# EAGLE design smart_motor_controller (EAGLE 9.0.0)
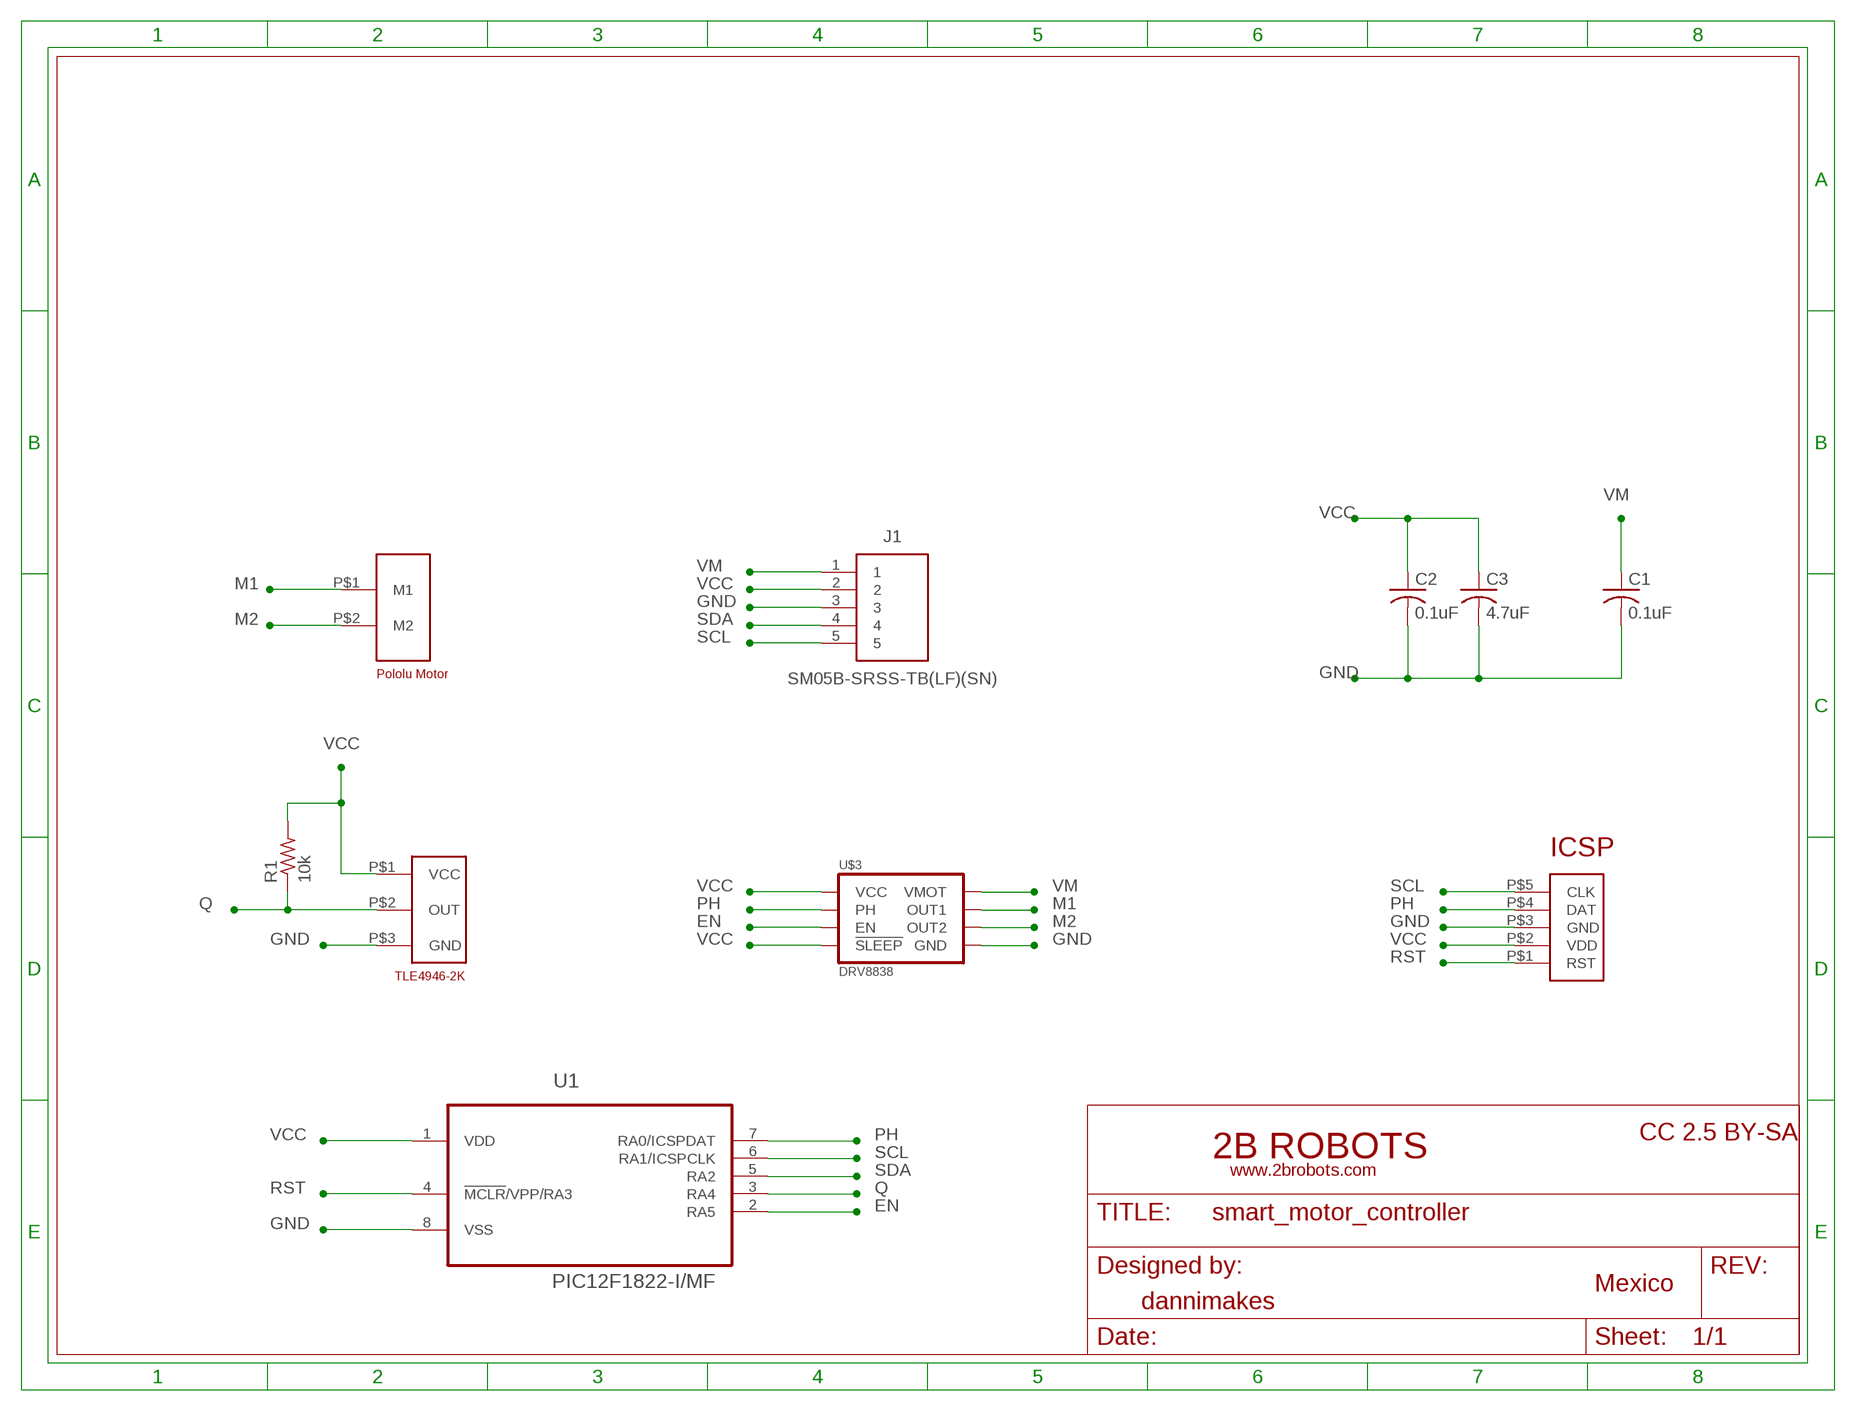
[diagram p0: schematic, sheet 1]

## Parts
C1  0.1uF  C-USC0603K  [C0603K]
C2  0.1uF  C-USC0603K  [C0603K]
C3  4.7uF  C-USC0805K  [C0805K]
J1  SM05B-SRSS-TB(LF)(SN)  [SM05B-SRSS-TB(LF)(SN)]
R1  10k  R-US_R0805  [R0805]
U1  PIC12F1822-I/MF  [DFN300X300X100-9N]
U$1  ICSP_POGO  [ICSP_POGO]
U$3  DRV8838  [DSG]
U$4  TLE4946-2K  [SC59]
U$5  POLOLU-MOTOR-BACK  [POLOL-MOTOR-BACK]

## Nets
EN: U1.2(RA5) U$3.5(EN)
GND: C1.2 C2.2 C3.2 J1.3 U1.8(VSS) U$1.P$3(GND) U$3.4(GND) U$3.PAD(GND) U$4.P$3(GND)
M1: U$3.2(OUT1) U$5.P$1(M1)
M2: U$3.3(OUT2) U$5.P$2(M2)
PH: U1.7(RA0/ICSPDAT) U$1.P$4(DAT) U$3.6(PH)
Q: R1.1 U1.3(RA4) U$4.P$2(OUT)
RST: U1.4(!MCLR!/VPP/RA3) U$1.P$1(RST)
SCL: J1.5 U1.6(RA1/ICSPCLK) U$1.P$5(CLK)
SDA: J1.4 U1.5(RA2)
VCC: C2.1 C3.1 J1.2 R1.2 U1.1(VDD) U$1.P$2(VDD) U$3.7(!SLEEP) U$3.8(VCC) U$4.P$1(VCC)
VM: C1.1 J1.1 U$3.1(VMOT)

## Library data of the parts
C1-C3 = adafruit:C-US: CAPACITOR, American symbol
J1 = SM05B-SRSS-TB(LF)(SN):SM05B-SRSS-TB(LF)(SN): czwka SMD, pozioma, 5 pinw <https://componentsearchengine.com/Images/9/SM05B-SRSS-TB%28LF%29%28SN%29.jpg> Source: Datasheet <http://www.jst-mfg.com/product/pdf/eng/eSH.pdf>; DESCRIPTION: czwka SMD, pozioma, 5 pinw; HEIGHT: mm; MANUFACTURER_NAME: JST (JAPAN SOLDERLESS TERMINALS); MANUFACTURER_PART_NUMBER: SM05B-SRSS-TB(LF)(SN); SUPPLIER_NAME: RS
R1 = adafruit:R-US_: RESISTOR, American symbol
U1 = Microchip-PIC12xxxx:PIC12: IC, 8BIT MCU, PIC12, 32MHZ, DFN-8; MPN: PIC12F1822-I/MF; OC_FARNELL: 1814913; OC_NEWARK: 63R7787; PACKAGE: DFN-8; SUPPLIER: MICROCHIP
U$1 = ICSP_POGO:ICSP_POGO
U$3 = packages(ti):DRV8838
U$4 = TLE4946-2K:TLE4946-2K
U$5 = pololu-motor-back:POLOLU-MOTOR-BACK

## Board
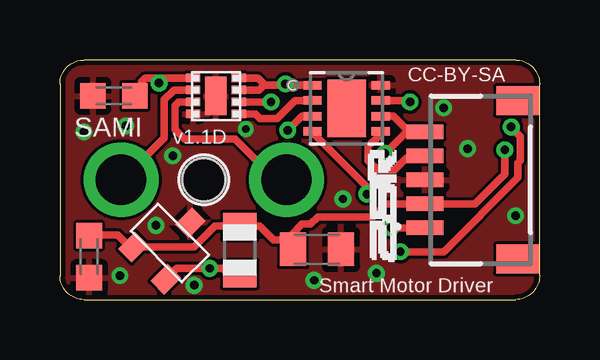
[diagram p1: board, top side]
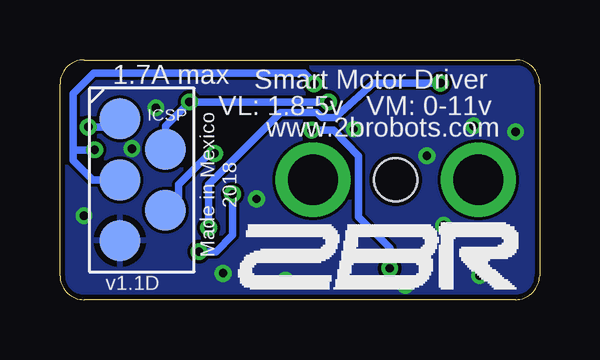
[diagram p2: board, bottom side, seen from below]

Size 20 x 10 mm. Coordinates in mm from the lower left corner, seen from the top.
Outline: 1,0 19,0 arc90 20,1 20,9 arc90 19,10 1,10 arc90 0,9 0,1 arc90 1,0
Copper layers (1*16): Top 0.0356mm / dielectric 1.5011mm / Bottom 0.0356mm
Design rules "test-5mil": minimum track width 6mil, minimum drill 0.3mm, track to track 5mil, track to pad 5mil, pad to pad 5mil, via to via 5mil, smd to smd 5mil, copper to edge 8mil, drill to drill 6mil, minimum pad ring 7mil, minimum via ring 7mil, stop-mask expansion 2.5mil, vias tented up to drill 50mil, thermal gap 10mil

### Footprints (pad centres in the part's own frame; a part is rotated, then mirrored left to right if it is on the bottom)
C0603K = smd 1.05 x 1.08: 1 -0.875,0; 2 0.875,0
C0805K = smd 1.1 x 1.4: 1 -1,0; 2 1,0
SM05B-SRSS-TB(LF)(SN) = smd 0.6 x 1.55: 1 -2,1; 2 -1,1; 3 0,1; 4 1,1; 5 2,1 | smd 1.2 x 1.8: 6 3.3,-2.875; 7 -3.3,-2.875
R0805 = smd 1.1 x 1.4: 1 -1,0; 2 1,0
DFN300X300X100-9N = smd 0.762 x 0.356: 1 -1.422,0.965; 2 -1.422,0.33; 3 -1.422,-0.33; 4 -1.422,-0.965; 5 1.422,-0.965; 6 1.422,-0.33; 7 1.422,0.33; 8 1.422,0.965 | smd 1.6 x 2.388: 9 0,0
ICSP_POGO = smd 1.7 x 1.7: P$1 -2.55,0; P$2 0.01,0; P$3 2.54,0; P$4 -1.275,1.9; P$5 1.275,1.9
DSG = smd 0.6 x 0.35: 1 -0.95,0.75; 2 -0.95,0.25; 3 -0.95,-0.25; 4 -0.95,-0.75; 5 0.95,-0.75; 6 0.95,-0.25; 7 0.95,0.25; 8 0.95,0.75 | smd 0.9 x 1.6: PAD 0,0
SC59 = smd 0.8 x 1: P$1 -0.9,-1.2; P$2 1,-1.2; P$3 0.05,1.2
POLOL-MOTOR-BACK = drill 2.1 pad 2.6: P$1 3.45,0; P$2 -3.45,0 | hole 1.8: 0,0

### Placement (x,y rotation side)
C1  2.25,8.5 180 top
C2  1.22,1.79 270 top
C3  10.72,2.1 0 top
J1  16.22,5 90 top
R1  7.5,2.07 90 top
U1  11.95,7.98 0 top
U$1  17.5,5 270 bottom
U$3  6.5,8.5 0 top
U$4  4.55,2.4 315 top
U$5  6,5 180 top

### Tracks (layer width: path | path; a pad name or v marks a point on that pad's centre or on a via)
EN
  Top 0.305: U$3.5 8.15,7.75 8.35,7.55 9.05,7.55 9.81,8.31 U1.2
GND  (via drill 0.3, 0.35)
  other vias: 2.5,1 1,7 2.75,7.25 4,3.1 7.75,7.12 5.6,0.6 10.6,0.8 13.2,1.1 19,3.5 17,6.3 16,8 11.8,4.2 4.7,6
  pour Top: 0,0 0,10 20,10 20,0
  pour Bottom: 0,0 20,0 20,10 0,10
M1
  Top 0.305: U$5.P$1 2.6,5 4.35,6.75 4.35,8.35 4.75,8.75 U$3.2
M2
  Top 0.305: U$3.3 4.95,8.25 4.9,8.2 4.8,8.1 4.8,7.1 5.2,6.7 7.3,6.7 9,5 U$5.P$2
PH  (via drill 0.35)
  Top 0.305: v14.6,8.25 14.54,8.31 U1.7 | U$3.6 v8.8,8.25
  Bottom 0.305: v8.8,8.25 v14.6,8.25 15.6,7.25 U$1.P$4
Q  (via drill 0.35)
  Top 0.305: U$4.P$2 4.86,1.3 v6.25,1.3 | R1.1 7.03,1.07 6.8,1.3 6.4,1.3 | v6.25,1.3 6.4,1.3 | 6.4,1.3 6.25,1.15 v6.25,1.3 | v9.5,7.07 10.1,7.65 U1.3
  Bottom 0.305: v6.25,1.3 6.25,2.15 7.55,3.45 7.55,6 8.6,7.07 v9.5,7.07
RST  (via drill 0.35)
  Top 0.305: 10.55,6.99 U1.4 10.53,6.97 12.8,4.7 v12.8,4.4 | v14.2,2 16,2 19.1,5.1 19.1,5.7 19.2,5.8 19.2,6.8 18.9,7.1 18.9,7.12 v18.82,7.2
  Bottom 0.305: v12.8,4.4 12.8,2.7 13.5,2 v14.2,2 | v14.2,2 14.3,2 v14.2,2 | v18.82,7.2 17.85,7.2 U$1.P$1
SCL  (via drill 0.35)
  Top 0.305: J1.5 15.17,7.05 14.55,7.05 | 14.55,7.05 14.5,7.05 | U1.6 13.9,7.65 14.5,7.05 | v13.55,6.1 14.5,7.05 | 14.5,7.05 14.55,7.05
  Bottom 0.305: U$1.P$5 15.05,4.28 15.05,4.8 13.8,6.05 13.55,6.05 v13.55,6.1
SDA
  Top 0.305: J1.4 15.12,5.9 14.45,5.9 13.95,5.4 13.25,5.4 12.85,5.8 12.85,6.4 13.37,6.87 U1.5
VCC  (via drill 0.35)
  Top 0.305: C2.1 1.16,2.7 2.4,2.7 2.91,2.19 U$4.P$1 5.6,2.2 6.47,3.07 R1.2 8.33,3.07 8.9,2.5 9.32,2.5 C3.1 9.72,2.77 10.1,3.15 10.45,3.15 10.75,3.45 13.05,3.45 13.6,4 J1.2 17.3,4 18.55,5.25 v18.55,6.25 | U1.1 9.36,8.95 9.35,8.95 | 8.55,8.95 8.5,8.95 8.3,8.75 U$3.7 | 8.55,8.95 8.25,9.25 U$3.8 | 9.35,8.95 8.55,8.95 | 9.35,8.95 v9.4,9
  Bottom 0.305: U$1.P$2 18.64,4.99 19.45,5.8 19.45,6.25 | 19.45,6.25 19.45,8.6 18.6,9.45 9.8,9.45 9.4,9.05 v9.4,9 | v18.55,6.25 19.45,6.25
VM  (via drill 0.35)
  Top 0.305: C1.1 3.4,8.78 3.4,9.1 3.55,9.25 4.15,9.25 | v13.8,3 J1.1 | U$3.1 4.15,9.25 | v4.13,9.04 4.13,9.23 4.15,9.25
  Bottom 0.305: v4.13,9.04 6.92,9.04 8.53,7.59 9.07,7.59 9.27,7.79 10.81,7.79 13.8,4.8 v13.8,3

### Text on the board
tPlace: CC-BY-SA | SAMI | v1.1D | Smart Motor Driver
bPlace: Smart Motor Driver | 1.7A max | VL: 1.8-5v VM: 0-11v | www.2brobots.com | Made in Mexico / 2018 | v1.1D